# Altium schematic sheet RFAMP.SchDoc: IF Amplifier
size Legal; CheckedBy: J. Brinton; CompanyName: Signal Laboratories, Inc.; DrawnBy: E. Chiu; Engineer: E. Chiu; Address1: 3479 Edison Way; Address2: Menlo Park CA 94025; Address3: +1 (877) 778-8435; Address4: siglabs.com; DocumentNumber: 48; Revision: 1; SheetNumber: 48; SheetTotal: 58
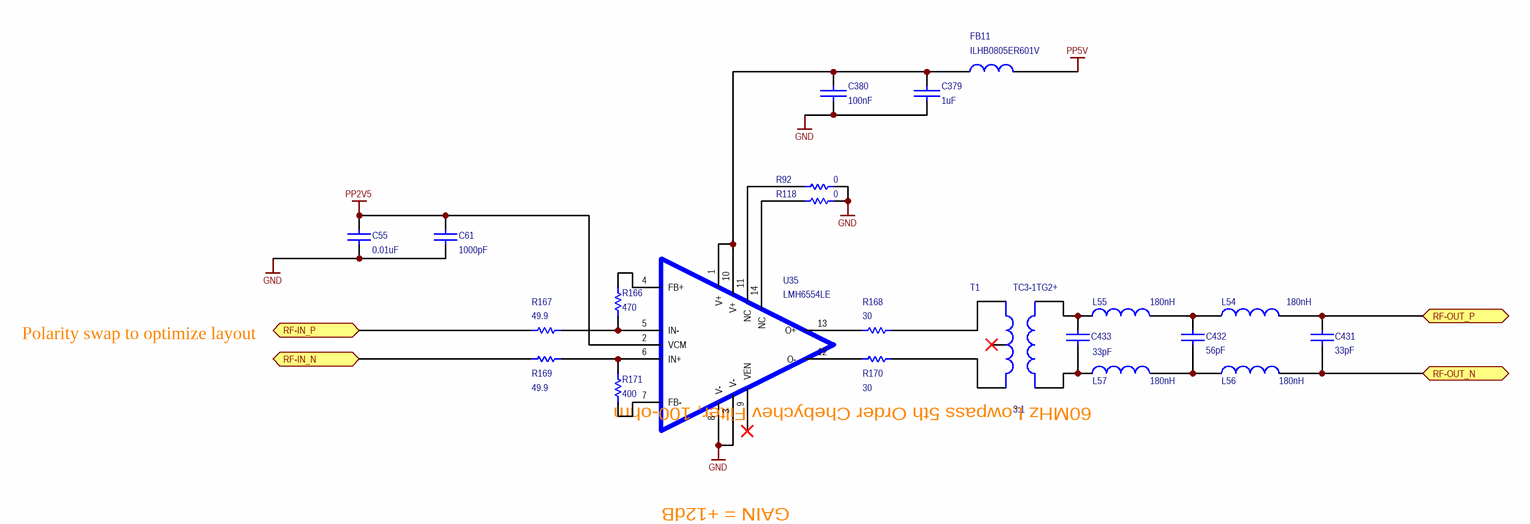
[diagram p0: RFAMP.SchDoc]

## Parts
C55  value 0.01uF  [0402]  (hidden comment: GRM155R71E103KA01D)
C61  value 1000pF  [0402]  (hidden comment: GRM1555C1H102JA01D)
C379  value 1uF  [0402]  (hidden comment: GRM155R61A105KE15D)
C380  value 100nF  [0402]  (hidden comment: GRM155R71C104KA88J)
C431  value 33pF  [0402]  (hidden comment: GRM1555C1H330JA01D)
C432  value 56pF  [0402]  (hidden comment: GRM1555C1H560JA01D)
C433  value 33pF  [0402]  (hidden comment: GRM1555C1H330JA01D)
FB11  ILHB0805ER601V  [0805]
L54  value 180nH  [0603]  (hidden comment: LQW18ANR18G00D)
L55  value 180nH  [0603]  (hidden comment: LQW18ANR18G00D)
L56  value 180nH  [0603]  (hidden comment: LQW18ANR18G00D)
L57  value 180nH  [0603]  (hidden comment: LQW18ANR18G00D)
R92  value 0  [0402]  (hidden comment: ERJ-2GE0R00X)
R118  value 0  [0402]  (hidden comment: ERJ-2GE0R00X)
R166  value 470  [0402]  (hidden comment: ERA-2AEB471X)
R167  value 49.9  [0402]  (hidden comment: ERA-2AEB49R9X)
R168  value 30  [0402]  (hidden comment: CPF0402B30RE1)
R169  value 49.9  [0402]  (hidden comment: ERA-2AEB49R9X)
R170  value 30  [0402]  (hidden comment: TE Connectivity)
R171  value 400  [0402]  (hidden comment: ERA-2AEB471X)
T1  value 3:1  [AT224-1A]  (hidden comment: TC3-1TG2+)
U35  LMH6554LE  [NHJ0014A]

## Ports
RF-IN_N, RF-IN_P, RF-OUT_N, RF-OUT_P

## Nets
GND: C55.1 C61.1 C379.1 C380.1 R92.2 R118.2 U35.3(V-) U35.8(V-)
PP2V5: C55.2 C61.2 U35.2(VCM)
PP5V: FB11.2
RF-IN_N: R169.2 ; port RF-IN_N
RF-IN_P: R167.2 ; port RF-IN_P
RF-OUT_N: C431.1 L56.1 ; port RF-OUT_N
RF-OUT_P: C431.2 L54.1 ; port RF-OUT_P
NetC379_2: C379.2 C380.2 FB11.1 U35.1(V+) U35.10(V+)
NetC432_1: C432.1 L56.2 L57.1
NetC432_2: C432.2 L54.2 L55.1
NetC433_1: C433.1 L57.2 T1.6(Pri+)
NetC433_2: C433.2 L55.2 T1.4(Pri-)
NetR92_1: R92.1 U35.11(NC)
NetR118_1: R118.1 U35.14(NC)
NetR166_1: R166.1 U35.4(FB+)
NetR166_2: R166.2 R167.1 U35.5(IN-)
NetR168_1: R168.1 T1.3(Sec-)
NetR168_2: R168.2 U35.13(O+)
NetR169_1: R169.1 R171.1 U35.6(IN+)
NetR170_1: R170.1 T1.1(Sec+)
NetR170_2: R170.2 U35.12(O-)
NetR171_2: R171.2 U35.7(FB-)

Not connected (* = marked no-connect by the designer): T1 2(SecCT)*; U35 9(VEN)*

## Notes on the sheet
- Polarity swap to optimize layout
- 60MHz Lowpass 5th Order Chebychev Filter, 100-ohm
- GAIN = +12dB
- Title
- Engineer
- Revision
- Drawn By
- Checked By
- Date
- Sheet
- of

## Library data of the parts
C55 = CAP 0402: Manufacturer: Murata; Voltage: 25V; Manufacturer P/N: GRM155R71E103KA01D; Package: 0402
C61 C431-C433 = CAP 0402: Manufacturer: Murata; Voltage: 50V; Package: 0402
  C61: Manufacturer P/N: GRM1555C1H102JA01D
  C431 C433: Manufacturer P/N: GRM1555C1H330JA01D
  C432: Manufacturer P/N: GRM1555C1H560JA01D
C379 = CAP: Ceramic Capacitor SMD; Manufacturer: Murata; Manufacturer P/N: GRM155R61A105KE15D; Package: 0402
C380 = CAP: Ceramic Capacitor SMD; Manufacturer: Murata; Voltage: 16V; Manufacturer P/N: GRM155R71C104KA88J; Package: 0402
FB11 = INDUCTANCE1: Ferrite Bead 600-Ohm @ 100MHz 0805; Manufacturer: Vishay Dale; Value: 600@100MHz; Manufacturer P/N: ILHB0805ER601V; Package: 0805
L54-L57 = INDUCTOR: Inductor Wirewound Air 91nH +/-2% SMD 0402; Manufacturer: Murata; Manufacturer P/N: LQW18ANR18G00D; Package: 0603
R92 R118 = RES 0402: Resistor, SMD 0402; Manufacturer: Panasonic; Package: 0402; Manufacturer P/N: ERJ-2GE0R00X
R166 R167 R169-R171 = RES 0402: Resistor, SMD 0402; Manufacturer: Panasonic; Tolerance: 0.1%; Package: 0402
  R166 R171: Manufacturer P/N: ERA-2AEB471X
  R167 R169: Manufacturer P/N: ERA-2AEB49R9X
  R170: Manufacturer P/N: TE Connectivity
R168 = RES 0402: Resistor, SMD 0402; Manufacturer: TE Connectivity; Tolerance: 0.1%; Package: 0402; Manufacturer P/N: CPF0402B30RE1
T1 = TC1-1TG2+: RF Transformer 0.4 to 500MHz SMD; Manufacturer: Mini-Circuits; Manufacturer P/N: TC3-1TG2+
U35 = LMH6554LE: 2.8 GHz Ultra Linear Fully Differential Amplifier; Manufacturer: Texas Instruments; Manufacturer P/N: LMH6554LE